# Altium schematic sheet Quectel M66.SchDoc: Quectel M66
size A4; CompanyName: github.com/aKaReZa75; Revision: 1.0; SheetNumber: 1; SheetTotal: 1; Project_Name: Design Template
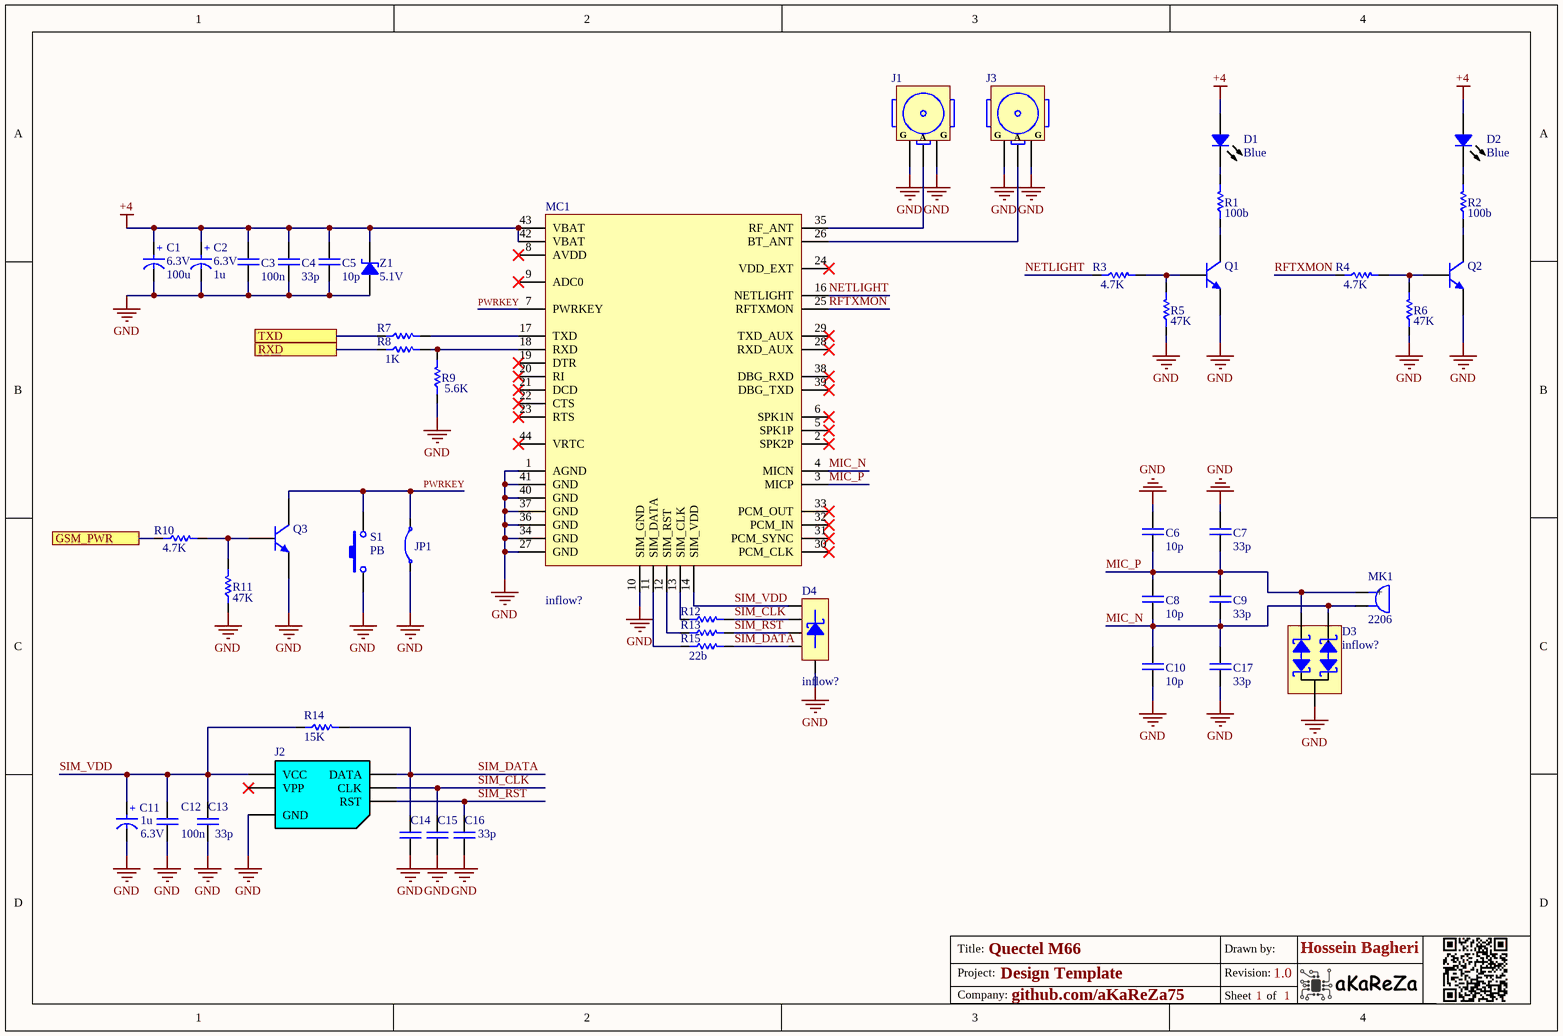
[diagram p0: Quectel M66.SchDoc]

## Parts
C1  Rating: 6.3V  [SMT_C_Tantalum_C]  (hidden comment: 100u)
C2  Rating: 6.3V  [SMT_C_Tantalum_A]  (hidden comment: 1u)
C3  100n  [CAP 1206/3216]
C4  33p  [CAP 1206/3216]
C5  10p  [CAP 1206/3216]
C6  10p  [CAP 0603/1608]
C7  33p  [CAP 0603/1608]
C8  10p  [CAP 0603/1608]
C9  33p  [CAP 0603/1608]
C10  10p  [CAP 0603/1608]
C11  Rating: 6.3V  [SMT_C_Tantalum_A]  (hidden comment: 1u)
C12  100n  [CAP 0805/2012]
C13  33p  [CAP 0805/2012]
C14  33p  [CAP 0805/2012]  (value not drawn)
C15  33p  [CAP 0805/2012]  (value not drawn)
C16  33p  [CAP 0805/2012]
C17  33p  [CAP 0603/1608]
D1  Blue  [LED 0805/2012 BLUE]
D2  Blue  [LED 0805/2012 BLUE]
D3  Inflow: inflow?  [SOT23_M]  (hidden comment: SM712)
D4  Inflow: inflow?  [SC70-5_N]  (hidden comment: SMF-05)
J1  U.FL  [IPEX-3x3mm]  (value not drawn)
J2  6'Pin  [GCT_SIM8051_Plastik]  (value not drawn)
J3  U.FL  [IPEX-3x3mm]  (value not drawn)
JP1  Jumper  [RESC2012M (0805)]  (value not drawn)
MC1  Inflow: inflow?  [m66]  (hidden comment: M66)
MK1  Inflow: 2206  [mic6]  (hidden comment: Mic)
Q1  NPN  [SOT23_N]  (value not drawn)
Q2  NPN  [SOT23_N]  (value not drawn)
Q3  NPN  [SOT23_N]  (value not drawn)
R1  100b  [RES 0805 (2012X06L)]
R2  100b  [RES 0805 (2012X06L)]
R3  4.7K  [RES 0805 (2012X06L)]
R4  4.7K  [RES 0805 (2012X06L)]
R5  47K  [RES 0805 (2012X06L)]
R6  47K  [RES 0805 (2012X06L)]
R7  1K  [RES 0805 (2012X06L)]  (value not drawn)
R8  1K  [RES 0805 (2012X06L)]
R9  5.6K  [RES 0805 (2012X06L)]
R10  4.7K  [RES 0805 (2012X06L)]
R11  47K  [RES 0805 (2012X06L)]
R12  22b  [RES 0805 (2012X06L)]  (value not drawn)
R13  22b  [RES 0805 (2012X06L)]  (value not drawn)
R14  15K  [RES 0805 (2012X06L)]
R15  22b  [RES 0805 (2012X06L)]
S1  PB  [SW_PB_SMD_2PIN_SPST_6X3X2]
Z1  5.1V  [SOD80, LL-34]

## Ports
GSM_PWR, RXD, TXD

## Nets
+4: C1.1(+) C2.1(+) C3.1 C4.1 C5.1 D1.1 D2.1 MC1.42(VBAT) MC1.43(VBAT) Z1.2
GND: C1.2(-) C2.2(-) C3.2 C4.2 C5.2 C6.1 C7.1 C10.2 C11.2(-) C12.2 C13.2 C14.2 C15.2 C16.2 C17.2 D3.3 D4.2(K) J1.2(G) J1.3(G) J2.5(GND) J3.2(G) J3.3(G) JP1.1 MC1.1(AGND) MC1.10(SIM_GND) MC1.27(GND) MC1.34(GND) MC1.36(GND) MC1.37(GND) MC1.40(GND) MC1.41(GND) Q1.2(E) Q2.2(E) Q3.2(E) R5.1 R6.1 R9.1 R11.1 S1.1 Z1.1
GSM_PWR: R10.1 ; port GSM_PWR
MIC_N: C8.2 C9.2 C10.1 C17.1 D3.2 MC1.4(MICN) MK1.2
MIC_P: C6.2 C7.2 C8.1 C9.1 D3.1 MC1.3(MICP) MK1.1(+)
NETLIGHT: MC1.16(NETLIGHT) R3.1
PWRKEY: JP1.2 MC1.7(PWRKEY) Q3.3(C) S1.2
RFTXMON: MC1.25(RFTXMON) R4.1
RXD: R8.1 ; port RXD
SIM_CLK: C15.1 D4.4(K) J2.3(CLK) R12.2
SIM_DATA: C14.1 D4.5(K) J2.4(DATA) R14.2 R15.2
SIM_RST: C16.1 D4.1(K) J2.2(RST) R13.2
SIM_VDD: C11.1(+) C12.1 C13.1 D4.3(K) J2.1(VCC) MC1.14(SIM_VDD) R14.1
TXD: R7.1 ; port TXD
NetD1_2: D1.2 R1.2
NetD2_2: D2.2 R2.2
NetJ1_1: J1.1(A) MC1.35(RF_ANT)
NetJ3_1: J3.1(A) MC1.26(BT_ANT)
NetMC1_11: MC1.11(SIM_DATA) R15.1
NetMC1_12: MC1.12(SIM_RST) R13.1
NetMC1_13: MC1.13(SIM_CLK) R12.1
NetMC1_17: MC1.17(TXD) R7.2
NetMC1_18: MC1.18(RXD) R8.2 R9.2
NetQ1_1: Q1.1(B) R3.2 R5.2
NetQ1_3: Q1.3(C) R1.1
NetQ2_1: Q2.1(B) R4.2 R6.2
NetQ2_3: Q2.3(C) R2.1
NetQ3_1: Q3.1(B) R10.2 R11.2

Not connected (* = marked no-connect by the designer): J2 6(VPP)*; MC1 2(SPK2P)* 5(SPK1P)* 6(SPK1N)* 8(AVDD)* 9(ADC0)* 19(DTR)* 20(RI)* 21(DCD)* 22(CTS)* 23(RTS)* 24(VDD_EXT)* 28(RXD_AUX)* 29(TXD_AUX)* 30(PCM_CLK)* 31(PCM_SYNC)* 32(PCM_IN)* 33(PCM_OUT)* 38(DBG_RXD)* 39(DBG_TXD)* 44(VRTC)*

## Notes on the sheet
- Title:
- Project:
- Drawn by:
- Revision:
- Hossein Bagheri
- Company:
- Sheet
- of

## Library data of the parts
C1 C2 C11 = Cap_Tantalum: Tantalum Capacitor,TAJ Series-SMD; Inflow: inflow?; Type: Tantalum
  C1: Package: SMD-C; Value: 100u
  C2 C11: Package: SMD-A; Value: 1u
C3 = Cap_Multi_SMD_100nF_1206: Bipolar ceramic capacitor SMD; Type: MultiLayer; Inflow: inflow?; Rating: 50V; Package: 1206; Value: 100n
C4 C5 = Cap_Multi_SMD_1206: Bipolar ceramic capacitor SMD; Inflow: inflow?; Type: MultiLayer; Rating: 50V; Package: 1206
  C4: Value: 33p
  C5: Value: 10p
C6-C10 C17 = Cap_Multi_SMD: Bipolar ceramic capacitor SMD; Inflow: inflow?; Type: Type?; Validation: Valid; Rating: Rating?; Package: Package?
  C6 C8 C10: Value: 10p
  C7 C9 C17: Value: 33p
C12 = Cap_Multi_SMD_100nF_0805: Bipolar ceramic capacitor SMD; Inflow: inflow?; Type: MultiLayer; Rating: 50V; Package: 0805; Value: 100n
C13-C16 = Cap_Multi_SMD_0805: Bipolar ceramic capacitor SMD; Inflow: inflow?; Type: MultiLayer; Rating: Rating?; Package: 0805; Value: 33p
D1 D2 = Semi_LED_SMD: LED; Inflow: inflow?; Rating: Rating?; Validation: Valid; Package: Package?; Type: LED; Value: Blue
D3 = Semi_Diod_TVS_SM712: TVS, ESD PROTECT, 2CH, 400W/17A PP, 7.5VBR, ±8KV ESDmin; Rating: Rating?; Type: Type?; Validation: Valid; Value: SM712; Package: Package?
D4 = Semi_Diod_TVS_SMF05: TVS Diode Array; Rating: Rating?; Validation: Valid; Type: TVS; Value: SMF-05; Package: SC70-5
J1 J3 = Con_RF_U.FL: Rating: Rating?; Inflow: inflow?; Type: RF; Package: SMD; Value: U.FL
J2 = Con_Socket_SimCard_1: Nano SimCard Holder 6P; Rating: Rating?; Validation: Valid; Inflow: inflow?; Package: SMD; Type: Nano; Value: 6'Pin
JP1 = Other_Elec_Jumper_0805: Jumper Component; Rating: Rating?; Inflow: inflow?; Validation: Valid; Type: Type?; Package: 0805; Value: Jumper
MC1 = ModSen_Com_M66: Quectel GSM/GPRS Module; Rating: Rating?; Validation: Valid; Package: Dip; Value: M66; Type: GSM-GPRS
MK1 = Other_Elec_Microphone: Microphone; Rating: Rating?; Validation: NT; Value: Mic; Package: Package?; Type: Type?
Q1-Q3 = Semi_BJT_BC817: NPN General purpose Transistor; Rating: Rating?; Type: Type?; Validation: Valid; Inflow: inflow?; Value: NPN; Package: Package?
R1-R15 = Res_SMD_0805: Resistor; Inflow: inflow?; Rating: 0.125W; Package: 0805; Type: 10%
  R1 R2: Value: 100b
  R3 R4 R10: Value: 4.7K
  R5 R6 R11: Value: 47K
  R7 R8: Value: 1K
  R9: Value: 5.6K
  R12 R13 R15: Value: 22b
  R14: Value: 15K
S1 = SW_PushButton_2_SMD: SMT Tactile ‎Switch; Rating: 2b; Validation: Valid; Inflow: 8260; Type: Vertical; Package: SMD; Value: PB
Z1 = Semi_Diod_Zener_SMD: Zener Diode; Rating: 0.5W; Inflow: inflow?; Type: Zener; Value: 5.1V; Package: SOD-80